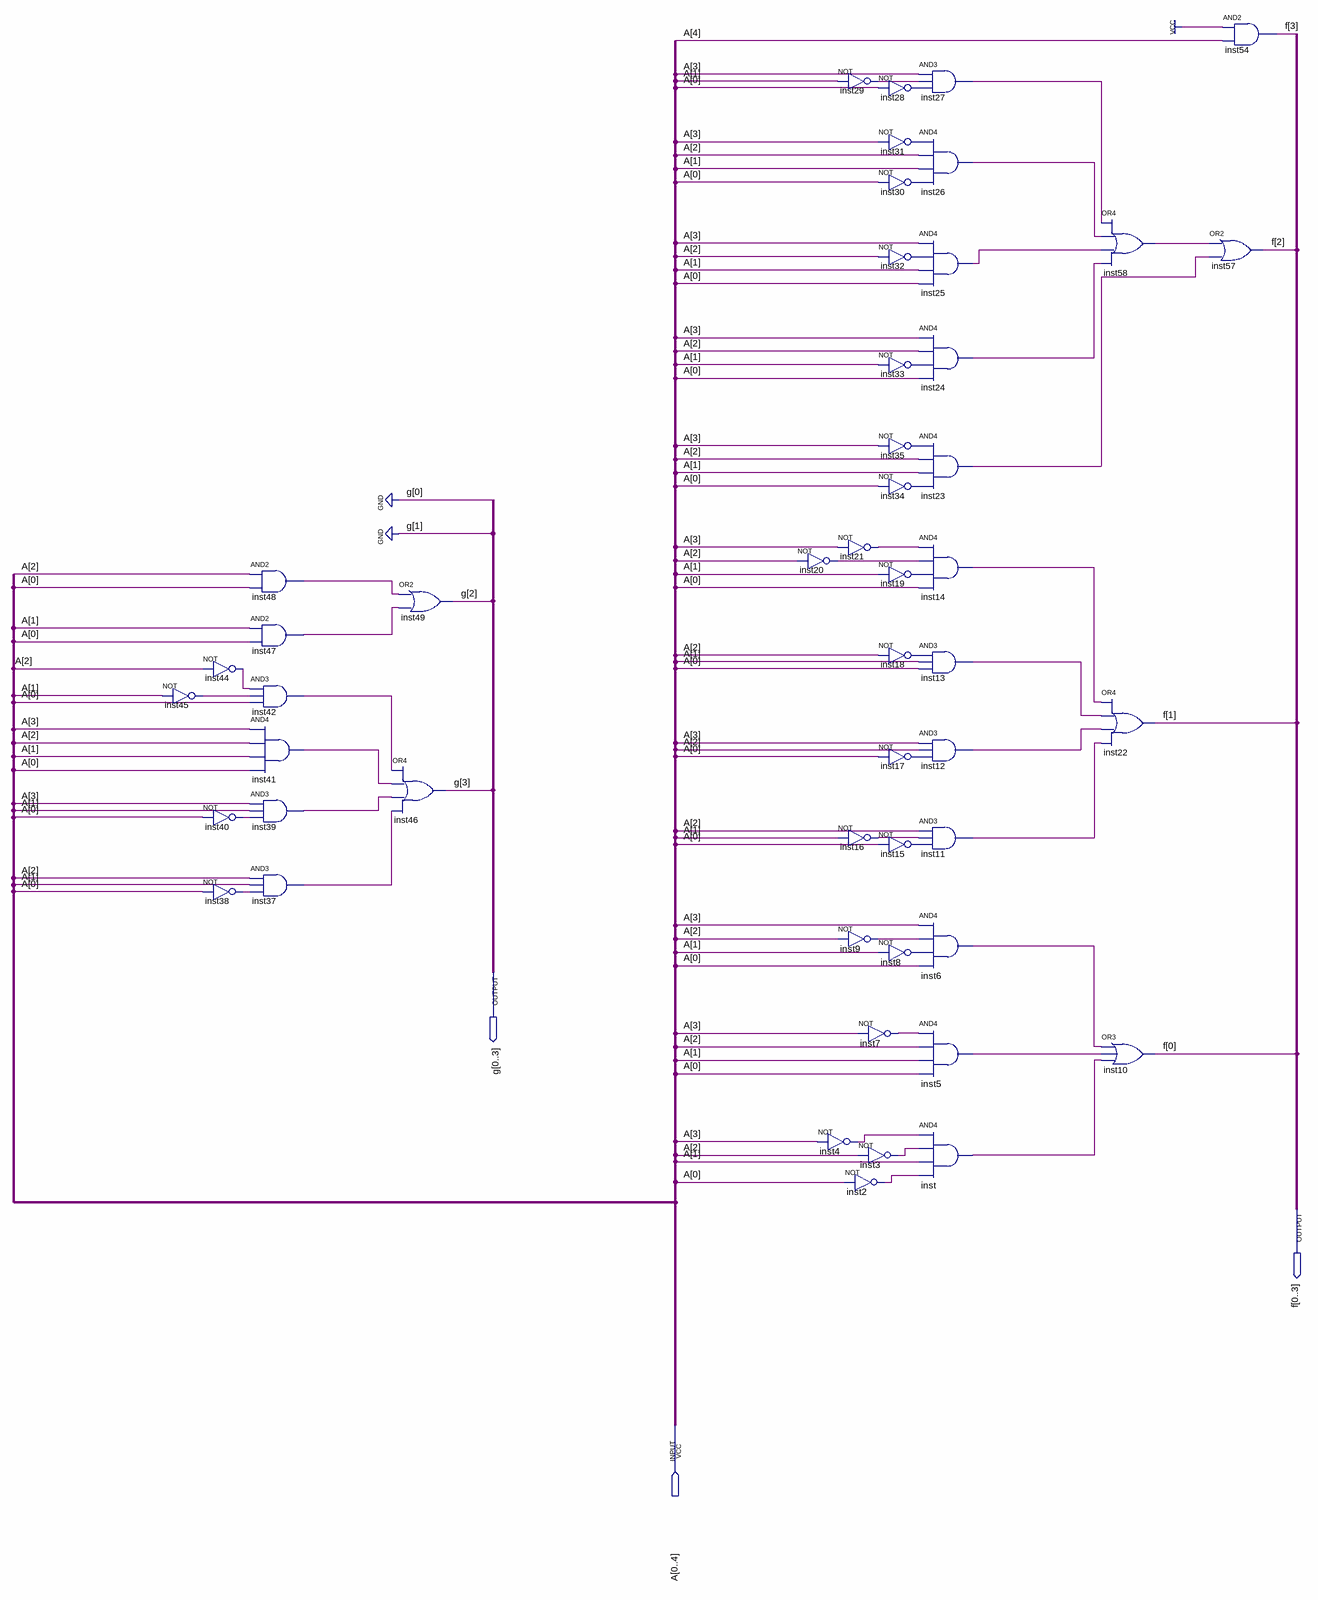
[diagram p0: schematic sheet]
// Quartus schematic DEC.bdf as structural Verilog: 50 symbols, 3 pins
module DEC (
  input  [0:4] A,
  output [0:3] g,
  output [0:3] f
);

  wire inst2_out, inst3_out, inst4_out, inst5_out, inst6_out, inst7_out, inst8_out, inst9_out, inst11_out,
       inst12_out, inst13_out, inst14_out, inst15_out, inst16_out, inst17_out, inst18_out, inst19_out,
       inst20_out, inst21_out, inst23_out, inst24_out, inst25_out, inst26_out, inst27_out, inst28_out,
       inst29_out, inst30_out, inst31_out, inst32_out, inst33_out, inst34_out, inst35_out, inst37_out,
       inst38_out, inst39_out, inst40_out, inst41_out, inst42_out, inst44_out, inst45_out, inst47_out,
       inst48_out, inst58_out, inst_out;

  not inst45 (inst45_out, A[1]);
  not inst44 (inst44_out, A[2]);
  not inst40 (inst40_out, A[0]);
  not inst38 (inst38_out, A[0]);
  and inst48 (inst48_out, A[2], A[0]);
  and inst47 (inst47_out, A[1], A[0]);
  and inst42 (inst42_out, inst44_out, inst45_out, A[0]);
  and inst41 (inst41_out, A[3], A[2], A[1], A[0]);
  and inst39 (inst39_out, A[3], A[1], inst40_out);
  and inst37 (inst37_out, A[2], A[1], inst38_out);
  or inst49 (g[2], inst48_out, inst47_out);
  or inst46 (g[3], inst42_out, inst41_out, inst39_out, inst37_out);
  not inst20 (inst20_out, A[2]);
  not inst4 (inst4_out, A[3]);
  not inst29 (inst29_out, A[1]);
  not inst28 (inst28_out, A[0]);
  not inst31 (inst31_out, A[3]);
  not inst30 (inst30_out, A[0]);
  not inst32 (inst32_out, A[2]);
  not inst33 (inst33_out, A[1]);
  not inst35 (inst35_out, A[3]);
  not inst34 (inst34_out, A[0]);
  not inst21 (inst21_out, A[3]);
  not inst19 (inst19_out, A[1]);
  not inst18 (inst18_out, A[2]);
  not inst17 (inst17_out, A[0]);
  not inst16 (inst16_out, A[1]);
  not inst15 (inst15_out, A[0]);
  not inst9 (inst9_out, A[2]);
  not inst8 (inst8_out, A[1]);
  not inst7 (inst7_out, A[3]);
  not inst3 (inst3_out, A[2]);
  not inst2 (inst2_out, A[0]);
  and inst27 (inst27_out, A[3], inst29_out, inst28_out);
  and inst26 (inst26_out, inst31_out, A[2], A[1], inst30_out);
  and inst25 (inst25_out, A[3], inst32_out, A[1], A[0]);
  and inst24 (inst24_out, A[3], A[2], inst33_out, A[0]);
  and inst23 (inst23_out, inst35_out, A[2], A[1], inst34_out);
  and inst14 (inst14_out, inst21_out, inst20_out, inst19_out, A[0]);
  and inst13 (inst13_out, inst18_out, A[1], A[0]);
  and inst12 (inst12_out, A[3], A[2], inst17_out);
  and inst11 (inst11_out, A[2], inst16_out, inst15_out);
  and inst6 (inst6_out, A[3], inst9_out, inst8_out, A[0]);
  and inst5 (inst5_out, inst7_out, A[2], A[1], A[0]);
  and inst (inst_out, inst4_out, inst3_out, A[1], inst2_out);
  or inst58 (inst58_out, inst27_out, inst26_out, inst25_out, inst24_out);
  or inst22 (f[1], inst14_out, inst13_out, inst12_out, inst11_out);
  or inst10 (f[0], inst6_out, inst5_out, inst_out);
  or inst57 (f[2], inst58_out, inst23_out);
  and inst54 (f[3], 1'b1, A[4]);

  assign g[0:1] = 2'b00;
endmodule
